# Altium schematic sheet BNO055_Xplained_pro.SchDoc: Bosch BNO055 extension
size A3; Organization: ATMEL Norway; Address1: Vestre Rosten 79; Address2: N-7075 TILLER; Address3: NORWAY; DocumentNumber: A09-2490; Revision: 2; SheetNumber: 1; SheetTotal: 1; PageSetup: Record=PageOptions|CenterHorizontal=True|CenterVertical=True|PrintScale=1.01|XCorrection=1.00|YCorrection=1.00|PrintKind=1|BorderSize=5000000|LeftOffset=0|BottomOffset=0|Orientation=2|PaperLength=1000|PaperWidth=1000|Scale=100|PaperSource=7|PrintQuality=-4|MediaType=1|DitherType=10|PaperKind=A3 (297 x 420 mm)|PrintScaleMode=1
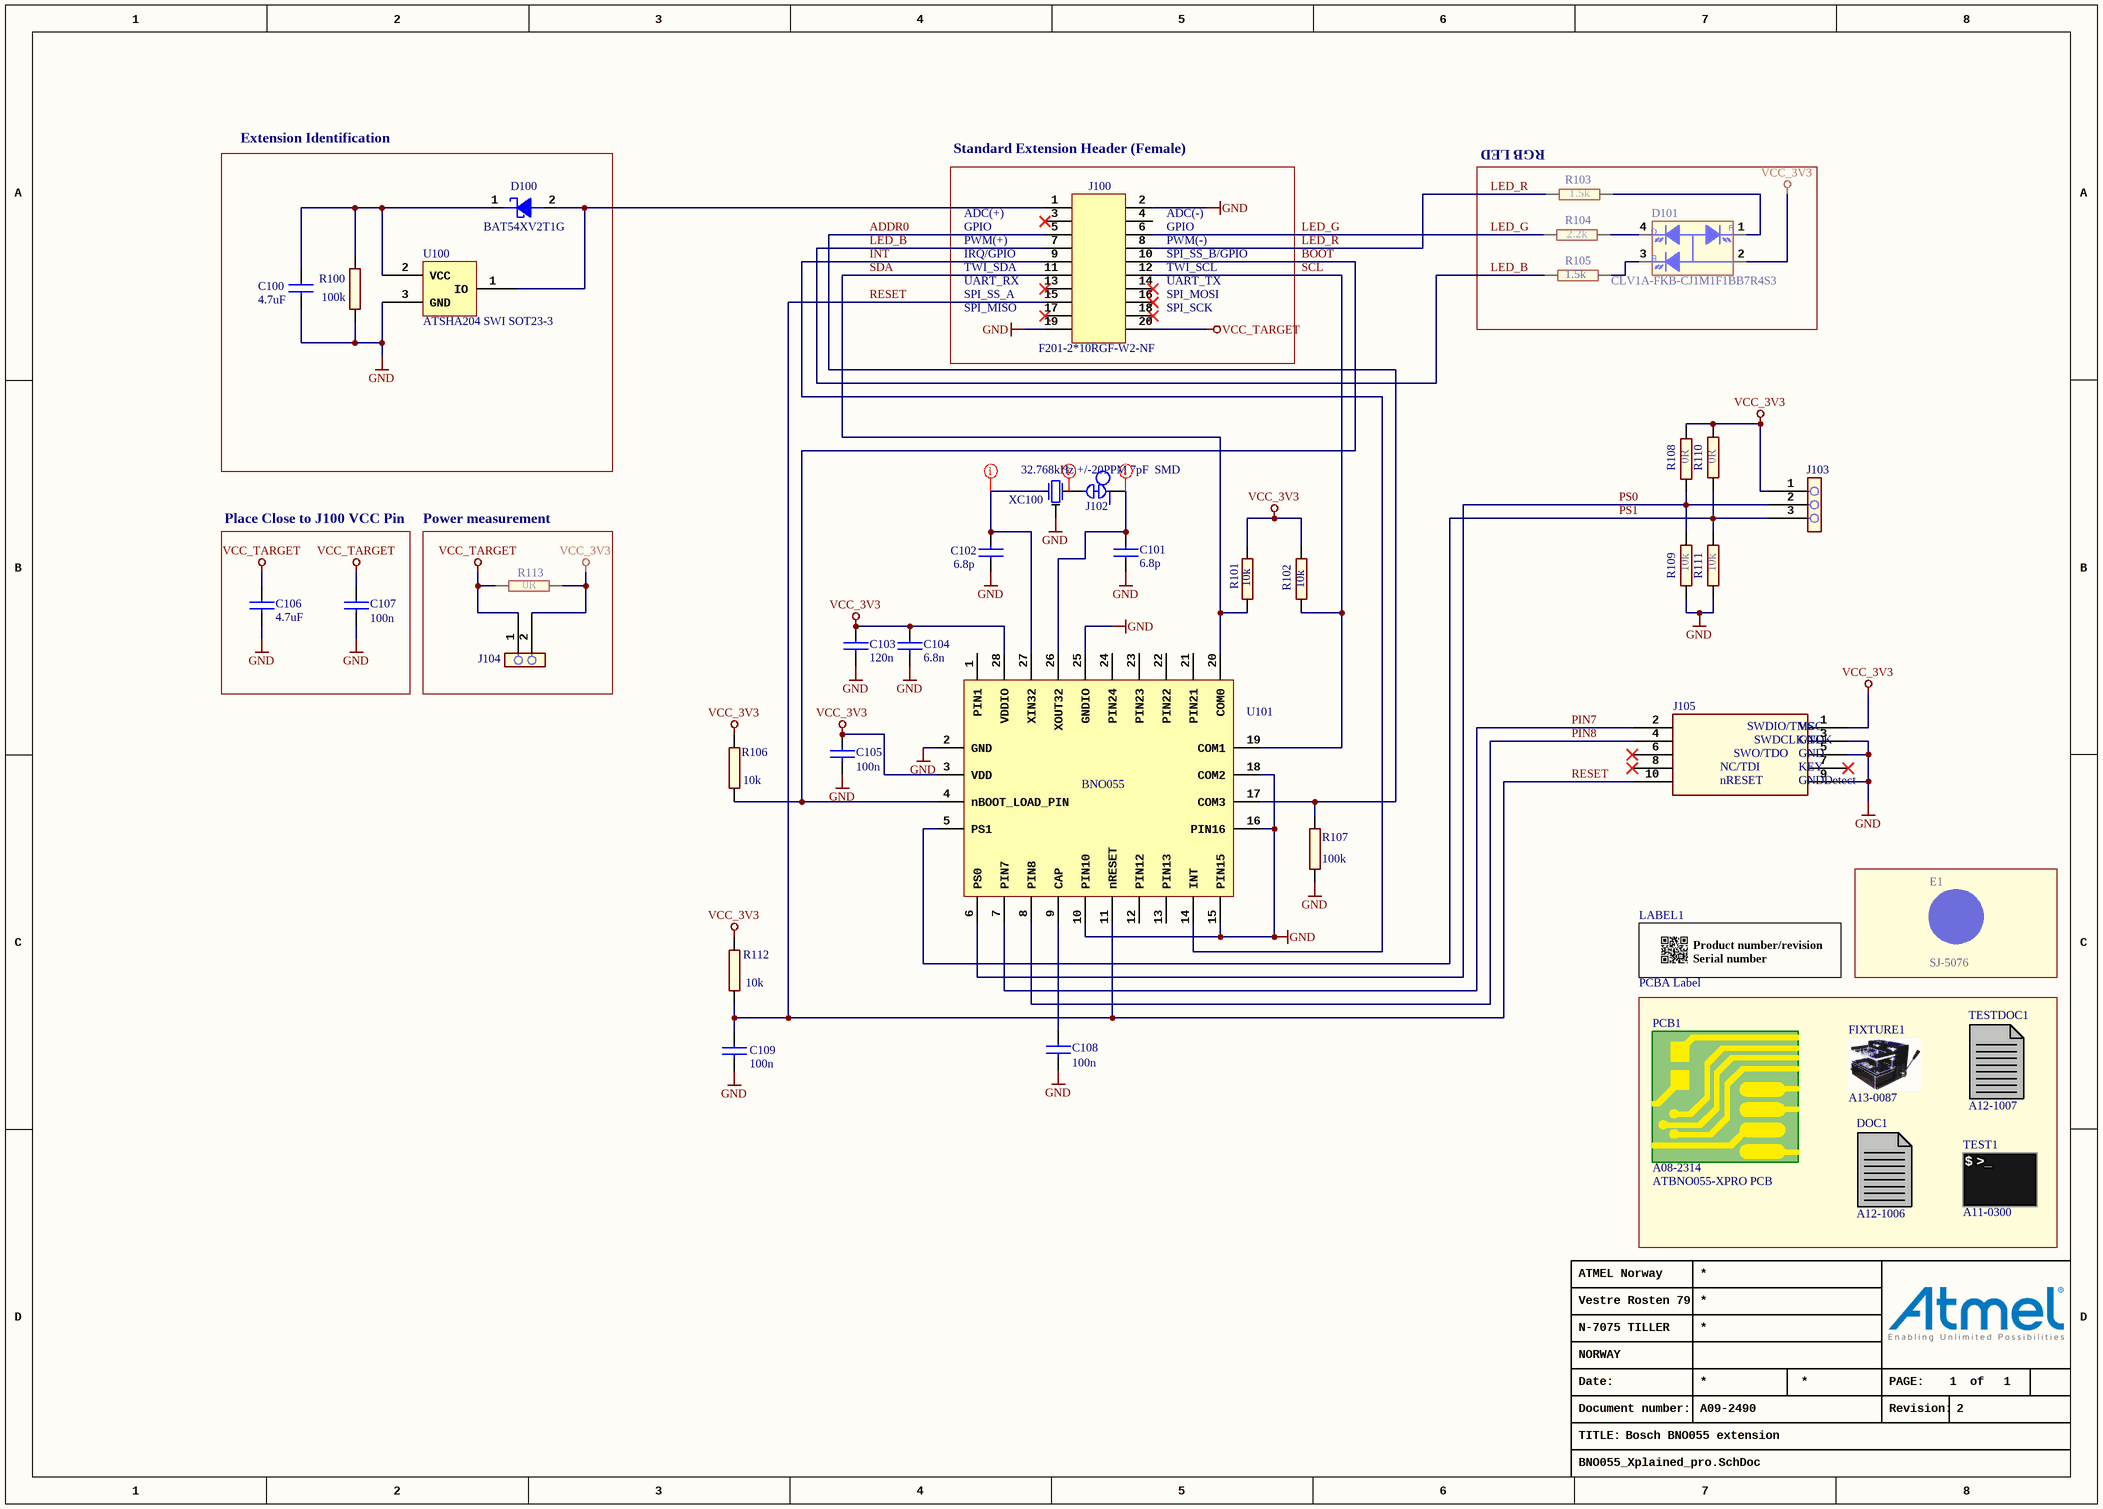
[diagram p0: BNO055_Xplained_pro.SchDoc]

## Parts
C100  value 4.7uF  [AP1-00001]
C101  value 6.8p  [AP1-00001]
C102  value 6.8p  [AP1-00001]
C103  value 120n  [AP1-00002]
C104  value 6.8n  [AP1-00001]
C105  value 100n  [AP1-00053]
C106  value 4.7uF  [AP1-00001]
C107  value 100n  [AP1-00053]
C108  value 100n  [AP1-00053]
C109  value 100n  [AP1-00053]
D100  value BAT54XV2T1G  [AP4-00036]  (hidden comment: Farnell# 1615809)
D101  value CLV1A-FKB-CJ1M1F1BB7R4S3  [AP4-00104]  (hidden comment: Farnell no: 1855553)
DOC1  AN: A12-1006  (mechanical)
E1  value SJ-5076  [AP8-00192]
FIXTURE1  AN: A13-0087  (mechanical)
J100  value F201-2*10RGF-W2-NF  [AP8-00621]
J102  (no value)  [AP8-00595]  (net tie, no BOM)
J103  (no value)  [AP8-00745]
J104  (no value)  [AP8-00733]
J105  (no value)  [AP8-00257]
LABEL1  value PCBA Label  [AP8-00317]
PCB1  value ATBNO055-XPRO PCB  AN: A08-2314  (mechanical)
R100  value 100k  [AP2-00000]
R101  value 10k  [AP2-00000]
R102  value 10k  [AP2-00000]
R103  value 1.5k  [AP2-00000]
R104  value 2.2k  [AP2-00000]
R105  value 1.5k  [AP2-00000]
R106  value 10k  [AP2-00000]
R107  value 100k  [AP2-00000]
R108  value 0R  [AP2-00000]
R109  value 10k  [AP2-00000]
R110  value 0R  [AP2-00000]
R111  value 10k  [AP2-00000]
R112  value 10k  [AP2-00000]
R113  value 0R  [AP2-00000]
TEST1  AN: A11-0300  (mechanical)
TESTDOC1  AN: A12-1007  (mechanical)
U100  value ATSHA204 SWI SOT23-3  [AP4-00018]
U101  value BNO055  [AP6-00430]
XC100  value 32.768kHz +/-20PPM 7pF  SMD  [AP7-00044]  (hidden comment: Farnell order no:1539364)

## Blocks framed on the sheet
Extension Identification: C100 D100 R100 U100
Standard Extension Header (Female): J100
Place Close to J100 VCC Pin: C106 C107
Power measurement: J104 R113

## Nets
GND: C100.2 C101.1 C102.1 C103.2 C104.2 C105.2 C106.2 C107.2 C108.2 C109.2 J100.2 J100.19 J105.3 J105.5 J105.9 R100.1 R107.1 R109.2 R111.2 U100.3(GND) U101.2(GND) U101.10(PIN10) U101.15(PIN15) U101.16(PIN16) U101.18(COM2) U101.25(GNDIO) XC100.3
VCC_3V3: C103.1 C104.1 C105.1 D101.2(COMMON_ANODE) J103.1 J104.2 J105.1 R101.2 R102.2 R106.2 R108.2 R110.2 R112.1 R113.1 U101.3(VDD) U101.28(VDDIO)
VCC_TARGET: C106.1 C107.1 J100.20 J104.1 R113.2
ADDR0: J100.5 R107.2 U101.17(COM3)
BOOT: J100.10 R106.1 U101.4(nBOOT_LOAD_PIN)
INT: J100.9 U101.14(INT)
LED_B: J100.7 R105.2
LED_G: J100.6 R104.2
LED_R: J100.8 R103.2
PIN7: J105.2 U101.7(PIN7)
PIN8: J105.4 U101.8(PIN8)
PS0: J103.2 R108.1 R109.1 U101.6(PS0)
PS1: J103.3 R110.1 R111.1 U101.5(PS1)
RESET: C109.1 J100.15 J105.10 R112.2 U101.11(nRESET)
SCL: J100.12 R102.1 U101.19(COM1)
SDA: J100.11 R101.1 U101.20(COM0)
NetC100_1: C100.1 D100.1(CATHODE) R100.2 U100.2(VCC)
NetC101_2: C101.2 J102.1 U101.26(XOUT32)
NetC102_2: C102.2 U101.27(XIN32) XC100.1
NetC108_1: C108.1 U101.9(CAP)
NetD100_2: D100.2(ANODE) J100.1 U100.1(IO)
NetD101_1: D101.1(CATHODE1) R103.1
NetD101_3: D101.3(CATHODE2) R105.1
NetD101_4: D101.4(CATHODE3) R104.1
NetJ102_2: J102.2 XC100.2

Not connected (* = marked no-connect by the designer): E1 1(FIDUCIAL); J100 3* 4 13* 14* 16* 17* 18*; J105 6* 7* 8*; U101 1(PIN1) 12(PIN12) 13(PIN13) 21(PIN21) 22(PIN22) 23(PIN23) 24(PIN24)

## Layout directives
rule Assembly Testpoint Usage [Testpoint - Not Allowed    Multiple - Not Allowed]: NetC101_2, NetC102_2, NetJ102_2

## Notes on the sheet
- (near R103) RGB LED
- ADC(+)
- PWM(+)
- GPIO
- (near J100) GPIO
- (near J100) ADC(-)
- (near J100) PWM(-)
- TWI_SDA
- UART_RX
- SPI_SS_A
- SPI_MISO
- IRQ/GPIO
- (near J100) TWI_SCL
- (near J100) UART_TX
- (near J100) SPI_MOSI
- (near J100) SPI_SCK
- (near J100) SPI_SS_B/GPIO
- Date:
- PAGE:
- of
- TITLE:
- Document number:
- Revision:
- (in symbol A08-0385) SWDIO/TMS; VCC; SWDCLK/TCK; GND; SWO/TDO; NC/TDI; KEY; nRESET; GNDDetect
- (in symbol A09-0611) / Product number/revision / Serial number
- (in symbol A10-0126) G; R; B
- (in symbol A11-0269) $ >_

## Library data of the parts
C100 C106 = A01-0347: Ceramic capacitor, SMD 0402, X5R, 6.3V, +/-20% (de33687); PartGroup: Capacitors,Ceramic,SMD 0402; Manufacturer: Murata; MPN: GRM155R60J475ME87D; Tolerance: +-20%; TemperatureRange: -55°C to +85°C; AN: A01-0347; Height: 0,5
C101 C102 = A01-0013: Ceramic capacitor, SMD 0402, NP0, 50V, +/-5%; PartGroup: Capacitors,Ceramic,SMD 0402; TemperatureRange: -55 - +125 deg C; AN: A01-0013; Tolerance: 50V, +/-5%; Height: 0,550000011920929
C103 = A01-0711: Ceramic capacitor, SMD 0603, X7R, 10V, Â±10%; PartGroup: Capacitors,Ceramic,SMD 0603; Manufacturer: AVX; MPN: 0603ZC124KAT2A; AN: A01-0711
C104 = A01-0048: Ceramic capacitor, SMD 0402, X7R, 25V, +/-10%; PartGroup: Capacitors,Ceramic,SMD 0402; TemperatureRange: -55 - +125 deg C; AN: A01-0048; Tolerance: 25V, +/-10%; Height: 0,550000011920929
C105 C107-C109 = A01-0246: Ceramic capacitor, SMD 0402, X7R, 16V, +/-10%; PartGroup: Capacitors,Ceramic,SMD 0402; Manufacturer: Kemet; MPN: C0402C104K4RACTU; TemperatureRange: -55 - +125 deg C; AN: A01-0246; Tolerance: 16V, +/-10%; Height: 0,5
D100 = A04-0049: Schottky diode, If:200mA, Vf:0.35V, Vrrm:30V, SOD-523; PartGroup: Diodes,Schottky; Manufacturer: ON Semiconductor; TemperatureRange: -55°C to +125°C; AN: A04-0049; Height: 0,699999988079071; MPN: BAT54XV2T1G
D101 = A10-0126: LED, RGB, diffuse lens, SMD PLCC-4; PartGroup: Opto,LEDs,SMD; Manufacturer: CREE; TemperatureRange: -40°C to +100°C; AN: A10-0126; Height: 1,89999997615814; MPN: CLV1A-FKB-CJ1M1F1BB7R4S3
DOC1 = A12-1006: ATBNO055-XPRO PCBA documentation; PartGroup: Documentation,PCBA Documents,Atmel; Value: ATBNO055-XPRO PCBA DOC
E1 = A08-0053: 2.8mm adhesive feet,diam 8.0mm; PartGroup: Mechanical devices,Mounting accessories; Manufacturer: 3M; AN: A08-0053; Height: 2,79999995231628; MPN: SJ-5076
FIXTURE1 = A13-0087: Xplained PRO Extension board Jupiter Test Fixture; PartGroup: Test Equipment,Test Fixtures; Manufacturer: ESCATEC; Value: Xplained PRO Extension board Jupiter Test Fixture; MPN: Xplained PRO Extension board Jupiter Test Fixture
J100 = A08-1512: 2x10, female pin header receptable, right-angled, 2.54mm pitch, THM, Pin In Paste; PartGroup: Mechanical devices,Connectors,Pin header receptacle; Manufacturer: Pro-data International Corp; AN: A08-1512; Height: 5,07999992370605; MPN: F201-2*10RGF-W2-NF
J102 = A08-1454: Closed Link 0402; PartGroup: Mechanical devices,PCB implemented components; AN: A08-1454; Value: Closed Link
J103 = A08-1799: 1x3 pin header, 2.54mm pitch, Pin-in-Paste THM, 1mm hole; PartGroup: Mechanical devices,Connectors,Pin headers; Manufacturer: SAMTEC; Value: HMTSW-103-23-F-S-237; AN: A08-1799; Height: 6,09999990463257; MPN: HMTSW-103-23-F-S-237
J104 = A08-1754: 1x2 pin header, 2.54mm pitch, Pin-in-Paste THM; PartGroup: Mechanical devices,Connectors,Pin headers; Manufacturer: SAMTEC; Value: HMTSW-102-23-F-S-237; TemperatureRange: - 55 deg C to + 125 deg C; AN: A08-1754; Height: 6,09999990463257; MPN: HMTSW-102-23-F-S-237
J105 = A08-0385: 2x5 pin header, 1.27mm pitch, THM; PartGroup: Mechanical devices,Connectors,Pin headers; Manufacturer: Garry; MPN: 176-2-010-0-T-XS0-0730; Value: PIN HEADER 2x5; AN: A08-0385; Height: 7,30000019073486
LABEL1 = A09-0611: PCBA identification label PP Top White Gloss; PartGroup: Mechanical devices,Packaging materials,Printed Labels; Manufacturer: ACT Logimark AS; MPN: 505462; AN: A09-0611
PCB1 = A08-2314: ATBNO055-XPRO PCB documentation; PartGroup: Mechanical devices,Printed circuit boards; Height: 1,60000002384186
R100 R107 = A02-0260: Thick film resistor, SMD 0402, 1/16W, 1%; PartGroup: Resistors,SMD,0402 1%; TemperatureRange: -55ï¿½ to +125ï¿½C; AN: A02-0260; Tolerance: 1 %; Height: 0,349999994039536
R101 R102 R106 R109 R111 R112 = A02-0236: Thick film resistor, SMD 0402, 1/16W, 1%; PartGroup: Resistors,SMD,0402 1%; Manufacturer: vishay; MPN: CRCW040210K0FKED; TemperatureRange: -55 - +125 deg C; AN: A02-0236; Tolerance: 1 %; Height: 0,349999994039536
R103 R105 = A02-0216: Thick film resistor, SMD 0402, 1/16W, 1%; PartGroup: Resistors,SMD,0402 1%; TemperatureRange: -55ï¿½ to +125ï¿½C; AN: A02-0216; Tolerance: 1 %; Height: 0,349999994039536
R104 = A02-0220: Thick film resistor, SMD 0402, 1/16W, 1%; PartGroup: Resistors,SMD,0402 1%; TemperatureRange: -55 - +125 deg C; AN: A02-0220; Tolerance: 1 %; Height: 0,349999994039536
R108 R110 R113 = A02-0163: RES 0.0 OHM 1/16W 0402 SMD; PartGroup: Resistors,SMD,0402 1%; Manufacturer: (n/a); MPN: RMCF0402ZT0R00; Tolerance: 1 %; TemperatureRange: -55 - +125 deg C; AN: A02-0163; Height: 0,349999994039536
TEST1 = A11-0269: PartGroup: Software,Test software,Tools; Value: Test SW for for A09-2378
TESTDOC1 = A12-1007: BNO055-XPRO, A09-2490, test instruction,; PartGroup: Documentation,Procedures,Test Instructions; Value: BNO055-XPRO test instruction
U100 = A06-0571: ATSHA204 with 1-wire interface and SOT23-3 package; PartGroup: Integrated Circuits,Special function,Encryption; Manufacturer: ATMEL; MPN: ATSHA204A-STUCZ-T; TemperatureRange: -40Â°C to +85Â°C; AN: A06-0571; Height: 1,12000000476837
U101 = A06-1259: Intelligent 9-Axis Absolute orientation sensor; PartGroup: Integrated Circuits,Sensors; Manufacturer: Bosch Sensortech GmbH; AN: A06-1259; Height: 1,17999994754791; MPN: BNO055
XC100 = A07-0052: 32k768 crystal, +-20ppm, CL=7pF, max ESR 60kOhm, SMD; MPN: MS1V-T1K 32.768kHz 7pF +/-20PPM TA; Manufacturer: Micro Crystal; PartGroup: Frequency devices,Crystals,SMD; Tolerance: +/- 20 PPM; TemperatureRange: -40 /+85; AN: A07-0052; Height: 2,07999992370605